# Altium schematic sheet Keypad.SchDoc
size A
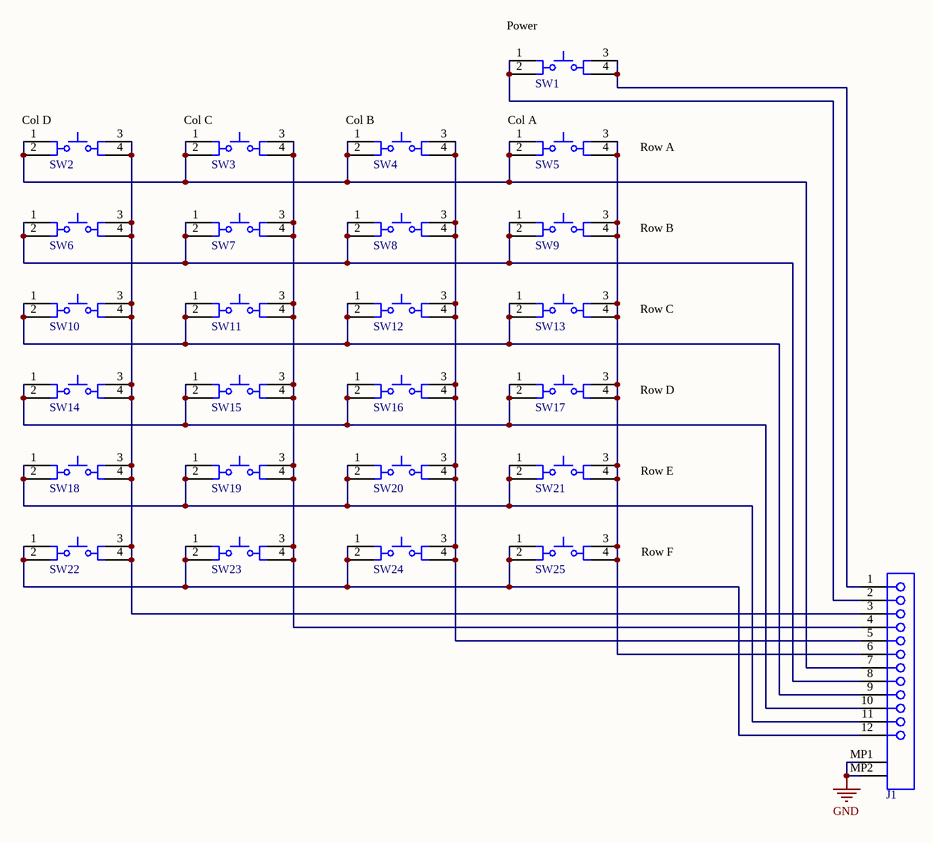
[diagram p0: Keypad.SchDoc]

## Parts
J1  52271-1279  [MOLX-52271-1279]  (value not drawn)
SW1  4-1437565-1  [TECO-4-1437565-1_V]  (value not drawn)
SW2  4-1437565-1  [TECO-4-1437565-1_V]  (value not drawn)
SW3  4-1437565-1  [TECO-4-1437565-1_V]  (value not drawn)
SW4  4-1437565-1  [TECO-4-1437565-1_V]  (value not drawn)
SW5  4-1437565-1  [TECO-4-1437565-1_V]  (value not drawn)
SW6  4-1437565-1  [TECO-4-1437565-1_V]  (value not drawn)
SW7  4-1437565-1  [TECO-4-1437565-1_V]  (value not drawn)
SW8  4-1437565-1  [TECO-4-1437565-1_V]  (value not drawn)
SW9  4-1437565-1  [TECO-4-1437565-1_V]  (value not drawn)
SW10  4-1437565-1  [TECO-4-1437565-1_V]  (value not drawn)
SW11  4-1437565-1  [TECO-4-1437565-1_V]  (value not drawn)
SW12  4-1437565-1  [TECO-4-1437565-1_V]  (value not drawn)
SW13  4-1437565-1  [TECO-4-1437565-1_V]  (value not drawn)
SW14  4-1437565-1  [TECO-4-1437565-1_V]  (value not drawn)
SW15  4-1437565-1  [TECO-4-1437565-1_V]  (value not drawn)
SW16  4-1437565-1  [TECO-4-1437565-1_V]  (value not drawn)
SW17  4-1437565-1  [TECO-4-1437565-1_V]  (value not drawn)
SW18  4-1437565-1  [TECO-4-1437565-1_V]  (value not drawn)
SW19  4-1437565-1  [TECO-4-1437565-1_V]  (value not drawn)
SW20  4-1437565-1  [TECO-4-1437565-1_V]  (value not drawn)
SW21  4-1437565-1  [TECO-4-1437565-1_V]  (value not drawn)
SW22  4-1437565-1  [TECO-4-1437565-1_V]  (value not drawn)
SW23  4-1437565-1  [TECO-4-1437565-1_V]  (value not drawn)
SW24  4-1437565-1  [TECO-4-1437565-1_V]  (value not drawn)
SW25  4-1437565-1  [TECO-4-1437565-1_V]  (value not drawn)

## Nets
GND: J1.MP1 J1.MP2
NetJ1_1: J1.1 SW1.3 SW1.4
NetJ1_2: J1.2 SW1.1 SW1.2
NetJ1_3: J1.3 SW2.3 SW2.4 SW6.3 SW6.4 SW10.3 SW10.4 SW14.3 SW14.4 SW18.3 SW18.4 SW22.3 SW22.4
NetJ1_4: J1.4 SW3.3 SW3.4 SW7.3 SW7.4 SW11.3 SW11.4 SW15.3 SW15.4 SW19.3 SW19.4 SW23.3 SW23.4
NetJ1_5: J1.5 SW4.3 SW4.4 SW8.3 SW8.4 SW12.3 SW12.4 SW16.3 SW16.4 SW20.3 SW20.4 SW24.3 SW24.4
NetJ1_6: J1.6 SW5.3 SW5.4 SW9.3 SW9.4 SW13.3 SW13.4 SW17.3 SW17.4 SW21.3 SW21.4 SW25.3 SW25.4
NetJ1_7: J1.7 SW2.1 SW2.2 SW3.1 SW3.2 SW4.1 SW4.2 SW5.1 SW5.2
NetJ1_8: J1.8 SW6.1 SW6.2 SW7.1 SW7.2 SW8.1 SW8.2 SW9.1 SW9.2
NetJ1_9: J1.9 SW10.1 SW10.2 SW11.1 SW11.2 SW12.1 SW12.2 SW13.1 SW13.2
NetJ1_10: J1.10 SW14.1 SW14.2 SW15.1 SW15.2 SW16.1 SW16.2 SW17.1 SW17.2
NetJ1_11: J1.11 SW18.1 SW18.2 SW19.1 SW19.2 SW20.1 SW20.2 SW21.1 SW21.2
NetJ1_12: J1.12 SW22.1 SW22.2 SW23.1 SW23.2 SW24.1 SW24.2 SW25.1 SW25.2

## Notes on the sheet
- (near SW1) Power
- (near SW2) Col D
- (near SW3) Col C
- (near SW4) Col B
- (near SW5) Col A
- (near SW5) Row A
- (near SW9) Row B
- (near SW13) Row C
- (near SW17) Row D
- (near SW21) Row E
- (near SW25) Row F

## Library data of the parts
J1 = CMP-1241-00238-1: 1.0 mm Pitch Easy-On(TM) Type FPC Connector, 3.0 mm Mated Height, Right Angle, ZIF, SMT, Bottom Contact, 12 Circuits, -40 to 85 degC, ELV and RoHS Compliant, Tape and Reel; Manufacturer: Molex; Entry Angle: 90degrees Angle; Material - Plating Termination: Tin-Bismuth; PCB Retention: Yes; Material - Metal: Phosphor Bronze; Mated Height: 3.00mm; Current (Max per Contact): 0.5A; Circuits (Loaded): 12; PCB Locator: No; Voltage (Max): 50V AC (RMS)/DC; Durability (mating cycles max): 30; Pitch - Mating Interface: 1.00mm; PackageReference: 52271-1279; Number of Rows: 1; ComponentLink3URL: http://www.molex.com/pdm_docs/sd/522711279_sd.pdf; Mounting Technology: Surface Mount; ComponentLink2Description: Datasheet; ComponentLink2URL: http://www.molex.com/webdocs/datasheets/pdf/en-us/0522711279_FFC_FPC_CONNECTORS.pdf; ComponentLink1Description: Manufacturer URL; Orientation: Right Angle; ComponentLink3Description: Package Specification; ComponentLink1URL: http://www.molex.com/molex/index.jsp; Pitch - Termination Interface: 1.00mm; PackageDescription: 12-Lead FPC Connector, Pitch 1.0 mm; Contact Position: Bottom; Packing: Tape and Reel; Polarized to PCB: Yes; PartNumber: 52271-1279; PackageVersion: Rev. B, 04/2004; Material - Plating Mating: Tin-Bismuth; RoHS: TRUE; Stackable: No
SW1-SW25 = CMP-2000-05602-1: Tactile Switch, 50 mA, 12 VDC, -20 to 85 degC, 4-Pin SMD, RoHS, Bulk; Manufacturer: TEConnectivity/AMPBrand; Illumination Type: N/R; Maximum Contact Resistance: 100mOhm; Actuator Style: RoundButton; Actuator Length: 1.4mm; Contact Rating @ Voltage: 0.05@12VDCA; Maximum DC Voltage Rating: 12V; Body Orientation: Straight; Ground Terminal: No; Dielectric Strength: 500VAC; Operating Force: 1.57N; Electrical Life: 100000Cycle; Mechanical Life: N/A; Family: FSMJSMA; Contact Material: CopperAlloy; Type: N/A; RoHS: Yes; Pole Throw Configuration: N/A; Operating Temperature: -20to85C; Minimum Insulation Resistance: 100MOhm; Package Description: 4-Pin Surface Mount Device, Body 6 x 6 mm, Pitch 9.1 mm; Housing Material: N/A; Switch Configuration: N/A; Mounting: SurfaceMount,GullWing; Datasheet URL: https://datasheet.ciiva.com/14635/0900766b80912216-14635826.pdf; Packaging: Bulk; Base Material: N/A; Actuator Color: N/A; Dimension: 6x10x5.25mm; Contact Plating: Silver; Seal Location: N/A; Mounting Technology: SurfaceMount; Part No: 4-1437565-1; Seal Description: N/A; Maximum AC Voltage Rating: N/A; Datasheet Version: 04/2007; Manufacturer URL: http://www.te.com/; Package Reference: 4-1437565-1; Product Weight: N/A